# EAGLE schematic heat_breadboard (EAGLE 6.2)
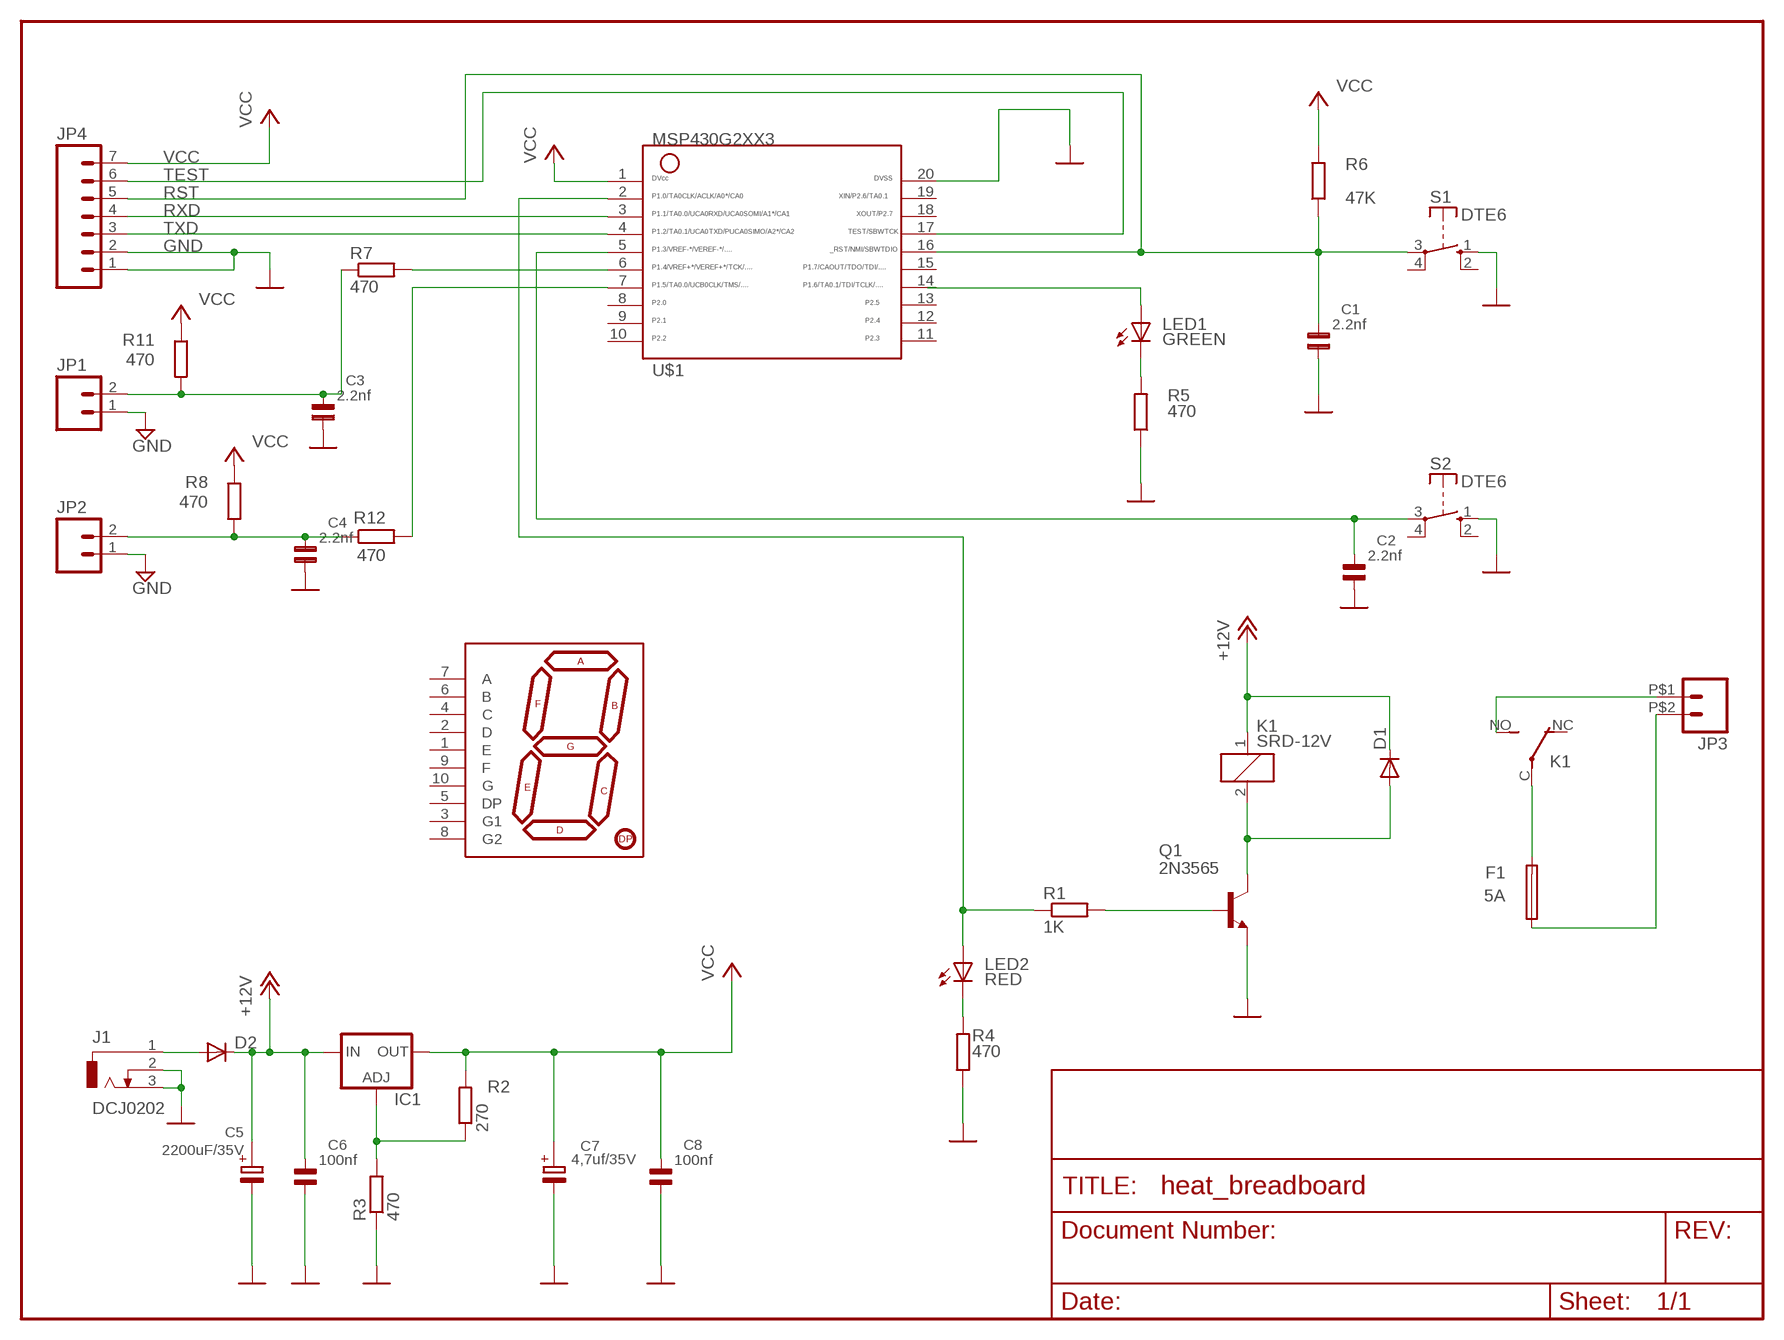
[diagram p0: schematic, sheet 1]

## Parts
C1  2.2nf  C5B2,5A  [C5B2,5A]
C2  2.2nf  C5B2,5A  [C5B2,5A]
C3  2.2nf  C5B2,5A  [C5B2,5A]
C4  2.2nf  C5B2,5A  [C5B2,5A]
C5  2200uF/35V  E35-16  [E35-16]
C6  100nf  C5B2,5A  [C5B2,5A]
C7  4,7uf/35V  E2-5@1  [E2,5-5]
C8  100nf  C5B2,5A  [C5B2,5A]
D1  DIODE-SMB  [SMB]
D2  DIODE-D-5  [D-5]
F1  5A  FUSEBLANK_5X20MM  [FUSE_HOLDER_5X20MM]
IC1  LM317TL  [317TL]
J1  DCJ0202  [DCJ0202]
JP1  M025MM  [SCREWTERMINAL-5MM-2]
JP2  M025MM  [SCREWTERMINAL-5MM-2]
JP3  M02PTH2  [1X02_BIG]
JP4  M07  [1X07]
K1  SRD-12V  JS-M1-12V-5  [SRD]
LED1  GREEN  LEDCHIP-LED0805  [CHIP-LED0805]
LED2  RED  LEDCHIP-LED0805  [CHIP-LED0805]
Q1  2N3565  [TO92]
R1  1K  R-EU_R0805  [R0805]
R2  270  R-EU_R0805  [R0805]
R3  470  R-EU_R0805  [R0805]
R4  470  R-EU_R0805  [R0805]
R5  470  R-EU_R0805  [R0805]
R6  47K  R-EU_R0805  [R0805]
R7  470  R-EU_R0805  [R0805]
R8  470  R-EU_R0805  [R0805]
R11  470  R-EU_R0805  [R0805]
R12  470  R-EU_R0805  [R0805]
S1  DTE6  [DTE6]
S2  DTE6  [DTE6]
U$1  G2XX3---PW20  [PW20]
U$2  7-SEGMENT-DISPLAY-1"-RED  [7-SEGMENT-1"PTH]

## Nets
+12V: C5.+ C6.2 D1.C D2.C IC1.3(IN) K1.1
GND: C1.1 C2.1 C3.1 C4.1 C5.- C6.1 C7.- C8.1 J1.2 J1.3 JP4.1 JP4.2 Q1.3(E) R3.1 R4.1 R5.1 S1.1(S) S2.1(S) U$1.20
N$1: JP3.P$1 K1.NO(2:S)
N$2: F1.2 K1.C(2:P)
N$3: IC1.1(ADJ) R2.1 R3.2
N$4: Q1.2(B) R1.2
N$5: D1.A K1.2 Q1.1(C)
N$6: F1.1 JP3.P$2
N$7: D2.A J1.1
N$8: LED2.C R4.2
N$9: LED2.A R1.1 U$1.2
N$10: LED1.A
N$11: LED1.C R5.2
N$13: C2.2 S2.3(P) U$1.5
N$15: R12.2 U$1.7
N$16: C3.2 JP1.2 R7.1 R11.2
N$17: C4.2 JP2.2 R8.2 R12.1
N$19: R7.2 U$1.6
RST: C1.2 JP4.5 R6.1 S1.3(P) U$1.16
RXD: JP4.4 U$1.3
TEST: JP4.6 U$1.17
TXD: JP4.3 U$1.4
VCC: C7.+ C8.2 IC1.2(OUT) JP4.7 R2.2 R6.2 R8.1 R11.1 U$1.1
Unconnected: JP1.1 JP2.1 K1.NC(2:O) S1.2(S) S1.4(P) S2.2(S) S2.4(P) U$1.8 U$1.9 U$1.10 U$1.11 U$1.12 U$1.13 U$1.14 U$1.15 U$1.18 U$1.19 U$2.1(E) U$2.2(D) U$2.3(G1) U$2.4(C) U$2.5(DP) U$2.6(B) U$2.7(A) U$2.8(G2) U$2.9(F) U$2.10(G)

## Library data of the parts
C1-C4 C6 C8 = CAP-WI:C5B2,5A
C5 = ELKO:E35-16
C7 = ELKO:E2-5@1
D1 D2 = diode:DIODE-: DIODE
F1 = fuse:FUSE: Fuse; OC_FARNELL: unknown; OC_NEWARK: unknown
IC1 = v-reg:LM317TL: VOLTAGE REGULATOR
J1 = con-jack:DCJ0202: DC POWER JACK Source: DCJ0202.pdf; OC_FARNELL: unknown; OC_NEWARK: unknown
JP1-JP3 = SparkFun:M02: Header 2 Standard 2-pin 0.1" header. Use with straight break away headers (SKU : PRT-00116), right angle break away headers (PRT-00553), swiss pins (PRT-00743), machine pins (PRT-00117), and female headers (PRT-00115). Molex polarized connector foot print use with SKU : PRT-08233 with associated crimp pins and housings.
JP4 = SparkFun:M07: Header 7 Standard 7-pin 0.1" header. Use with straight break away headers (SKU : PRT-00116), right angle break away headers (PRT-00553), swiss pins (PRT-00743), machine pins (PRT-00117), and female headers (PRT-00115). NOTES ON THE VARIANTS LOCK and LOCK_LONGPADS... This footprint was designed to help hold the alignment of a through-hole component (i.e. 7-pin header) while soldering it into place. You may notice that each hole has been shifted either up or down by 0.005 of an inch from it's more standard position (which is usually a perfectly straight line). This slight alteration caused the pins (the squares in the middle) to touch the edges of the holes. Because they are alternating, it causes a "brace" to hold the header in place. 0.005 has proven to be the perfect amount of "off-center" position when using our standard breakaway headers. Although looks a little odd when you look at the bare footprint, once you have a header in there, the alteration is very hard to notice. Also, if you push a header all the way into place, it is covered up entirely on the bottom side. This idea of altering the position of holes to aid alignment will be further integrated into the Sparkfun Library for other footprints. It can help hold any component with 3 or more connection pins.
K1 = jlab:JS-M1*: SRD power relayy Source: http://www.spb-planeta.ru/pdf/srd.pdf; MF: FARNELL; MPN: JSM1-12V-5; OC_FARNELL: 910351; OC_NEWARK: 14J1764
LED1 LED2 = led:LED: LED OSRAM: - CHIPLED LG R971, LG N971, LY N971, LG Q971, LY Q971, LO R971, LY R971 LH N974, LH R974 LS Q976, LO Q976, LY Q976 LO Q996 - Hyper CHIPLED LW Q18S LB Q993, LB Q99A, LB R99A - SideLED LS A670, LO A670, LY A670, LG A670, LP A670 LB A673, LV A673, LT A673, LW A673 LH A674 LY A675 LS A676, LA A676, LO A676, LY A676, LW A676 LS A679, LY A679, LG A679 - Hyper Micro SIDELED® LS Y876, LA Y876, LO Y876, LY Y876 LT Y87S - SmartLED LW L88C, LW L88S LB L89C, LB L89S, LG L890 LS L89K, LO L89K, LY L89K LS L896, LA L896, LO L896, LY L896 - TOPLED LS T670, LO T670, LY T670, LG T670, LP T670 LSG T670, LSP T670, LSY T670, LOP T670, LYG T670 LG T671, LOG T671, LSG T671 LB T673, LV T673, LT T673, LW T673 LH T674 LS T676, LA T676, LO T676, LY T676, LB T676, LH T676, LSB T676, LW T676 LB T67C, LV T67C, LT T67C, LS T67K, LO T67K, LY T67K, LW E67C LS E67B, LA E67B, LO E67B, LY E67B, LB E67C, LV E67C, LT E67C LW T67C LS T679, LY T679, LG T679 LS T770, LO T770, LY T770, LG T770, LP T770 LB T773, LV T773, LT T773, LW T773 LH T774 LS E675, LA E675, LY E675, LS T675 LS T776, LA T776, LO T776, LY T776, LB T776 LHGB T686 LT T68C, LB T68C - Hyper Mini TOPLED® LB M676 - Mini TOPLED Santana® LG M470 LS M47K, LO M47K, LY M47K Source: http://www.osram.convergy.de LUXEON: - LUMILED® LXK2-PW12-R00, LXK2-PW12-S00, LXK2-PW14-U00, LXK2-PW14-V00 LXK2-PM12-R00, LXK2-PM12-S00, LXK2-PM14-U00 LXK2-PE12-Q00, LXK2-PE12-R00, LXK2-PE12-S00, LXK2-PE14-T00, LXK2-PE14-U00 LXK2-PB12-K00, LXK2-PB12-L00, LXK2-PB12-M00, LXK2-PB14-N00, LXK2-PB14-P00, LXK2-PB14-Q00 LXK2-PR12-L00, LXK2-PR12-M00, LXK2-PR14-Q00, LXK2-PR14-R00 LXK2-PD12-Q00, LXK2-PD12-R00, LXK2-PD12-S00 LXK2-PH12-R00, LXK2-PH12-S00 LXK2-PL12-P00, LXK2-PL12-Q00, LXK2-PL12-R00 Source: www.luxeon.com KINGBRIGHT: KA-3528ASYC Source: www.kingbright.com
Q1 = transistor-npn:2N3565: NPN Transistor
R1-R8 R11 R12 = rcl:R-EU_: RESISTOR, European symbol
S1 S2 = jlab:DT: 5x5 push button
U$1 = TI_MSP430_v16:G2XX3---PW20: MSP430G2XX1 TSSOP (PW) 20 Pin Package
U$2 = SparkFun-Displays:7-SEGMENT-DISPLAY-1"-RED: 7-Segment Display 1" Red (COM-08546)

## Net classes
1 supply: width 1.143 mm